# EAGLE schematic nerf_ammo_counter (EAGLE 9.3.0)
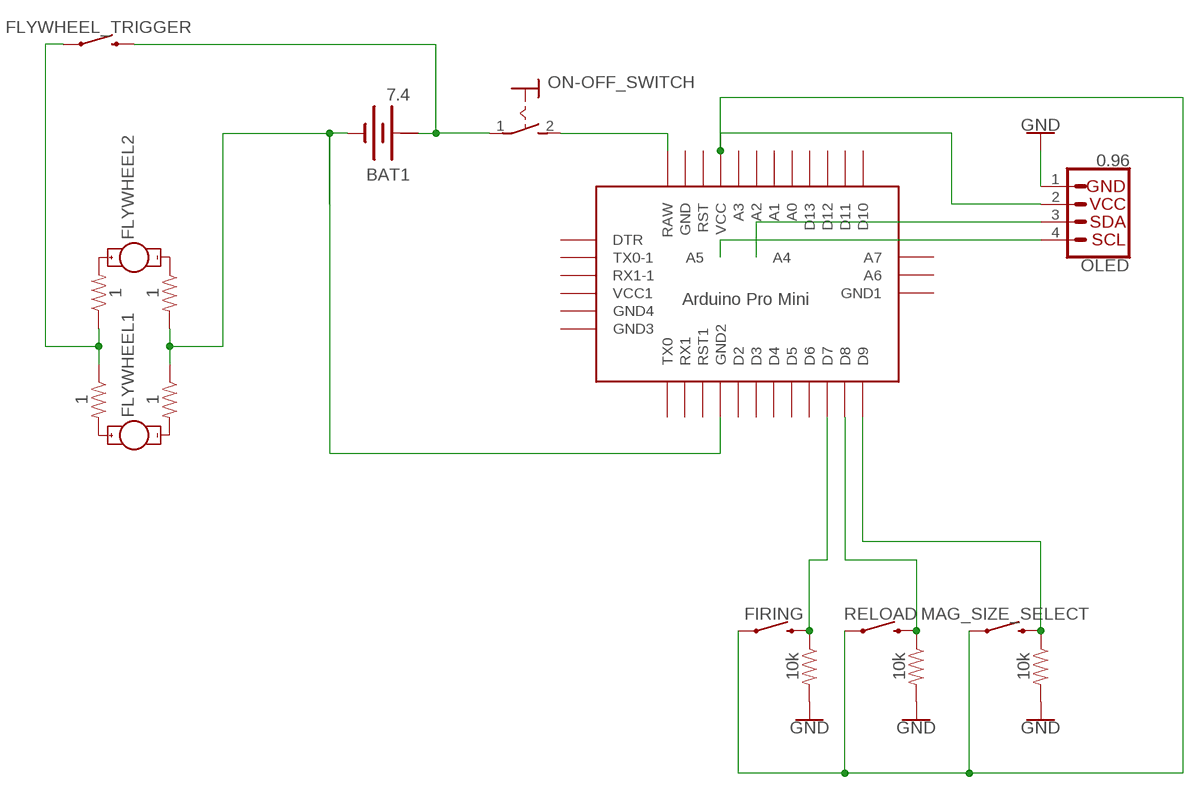
[diagram p0: schematic, sheet 1]

## Parts
BAT1  7.4  BATTERY  [BATTERY]
FIRING  MOMENTARY-SWITCH-SPST-PTH-6.0MM  [TACTILE_SWITCH_PTH_6.0MM]
FLYWHEEL1  MOTOR10MM  [VIBE-MOTOR-10MM]
FLYWHEEL2  MOTOR10MM  [VIBE-MOTOR-10MM]
FLYWHEEL_TRIGGER  MOMENTARY-SWITCH-SPST-PTH-6.0MM  [TACTILE_SWITCH_PTH_6.0MM]
MAG_SIZE_SELECT  MOMENTARY-SWITCH-SPST-PTH-6.0MM  [TACTILE_SWITCH_PTH_6.0MM]
OLED  0.96  I2C_STANDARD  [1X04]
ON-OFF_SWITCH  MS243  [MS243]
R1  10k  10KOHM-HORIZ-1/4W-1%  [AXIAL-0.3]
R2  10k  10KOHM-HORIZ-1/4W-1%  [AXIAL-0.3]
R3  10k  10KOHM-HORIZ-1/4W-1%  [AXIAL-0.3]
R4  1  1OHM-0603-1/10W-1%  [0603]
R5  1  1OHM-0603-1/10W-1%  [0603]
R6  1  1OHM-0603-1/10W-1%  [0603]
R7  1  1OHM-0603-1/10W-1%  [0603]
RELOAD  MOMENTARY-SWITCH-SPST-PTH-6.0MM  [TACTILE_SWITCH_PTH_6.0MM]
U$1  ABK-PRO-MINI  [ABK-PRO-MINI]

## Nets
GND: OLED.1 R1.P$2 R2.P$2 R3.P$2
N$1: OLED.4 U$1.A5
N$2: OLED.3 U$1.A4
N$3: FIRING.1 MAG_SIZE_SELECT.1 OLED.2 RELOAD.1 U$1.VCC
N$4: BAT1.- R6.2 R7.1 U$1.GND1(GND2)
N$5: ON-OFF_SWITCH.2(S) U$1.RAW
N$6: BAT1.+ FLYWHEEL_TRIGGER.3 ON-OFF_SWITCH.1(P)
N$7: MAG_SIZE_SELECT.3 R3.P$1 U$1.D9
N$9: R2.P$1 RELOAD.3 U$1.D8
N$10: FIRING.3 R1.P$1 U$1.D7
N$11: FLYWHEEL2.+ FLYWHEEL_TRIGGER.1 R4.1 R5.1 R5.2
N$12: FLYWHEEL2.- R6.1
N$13: FLYWHEEL1.- R7.2
N$14: FLYWHEEL1.+ R4.2
Unconnected: U$1.A0 U$1.A1 U$1.A2 U$1.A3 U$1.A6 U$1.A7 U$1.D2 U$1.D3 U$1.D4 U$1.D5 U$1.D6 U$1.D10 U$1.D11 U$1.D12 U$1.D13 U$1.DTR U$1.GND U$1.GND2(GND3) U$1.GND3(GND4) U$1.GND4(GND1) U$1.RST U$1.RST1 U$1.RX1 U$1.RX1-1 U$1.TX0 U$1.TX0-1 U$1.VCC1

## Power pins joined to a net without a drawn wire
+: BAT1.+@1(+)

## Library data of the parts
BAT1 = special:BATTERY: BATTERY
FIRING FLYWHEEL_TRIGGER MAG_SIZE_SELECT RELOAD = SparkFun-Switches:MOMENTARY-SWITCH-SPST: Momentary Switch (Pushbutton) - SPST Normally-open (NO) SPST momentary switches (buttons, pushbuttons). Variants PTH-12MM - 12mm square, through-hole Momentary Pushbutton Switch - 12mm Square <https://www.sparkfun.com/products/9190> (COM-09190) PTH-6.0MM, PTH-6.0MM-KIT - 6.0mm square, through-hole Mini Pushbutton Switch <https://www.sparkfun.com/products/97> (COM-00097) KIT package intended for soldering kit's - only one side of pads' copper is exposed. PTH-RIGHT-ANGLE-KIT - Right-angle, through-hole Right Angle Tactile Button <https://www.sparkfun.com/products/10791> - Used on SparkFun BigTime Watch Kit <https://www.sparkfun.com/products/11734> SMD-12MM - 12mm square, surface-mount Tactile Button - SMD (12mm) <https://www.sparkfun.com/products/12993> (COM-12993) Used on SparkFun PicoBoard <https://www.sparkfun.com/products/11888> SMD-4.5MM - 4.5mm Square Trackball Switch Used on SparkFun Blackberry Trackballer Breakout <https://www.sparkfun.com/products/13169> SMD-4.6MMX2.8MM - 4.60mm x 2.80mm, surface mount Used on SparkFun SAMD21 Mini Breakout <https://www.sparkfun.com/products/13664> SMD-5.2MM, SMD-5.2-REDUNDANT - 5.2mm square, surface-mount Mini Pushbutton Switch - SMD <https://www.sparkfun.com/products/8720> (COM-08720) Used on Arduino Pro Mini <https://www.sparkfun.com/products/11114> REDUNDANT package connects both switch circuits together SMD-6.0X3.5MM - 6.0 x 3.5mm, surface mount Momentary Reset Switch SMD <https://www.sparkfun.com/products/8229> (COM-08229) SMD-6.2MM-TALL - 6.2mm square, surface mount Tactile Button - SMD (6mm) <https://www.sparkfun.com/products/12992> Used on SparkFun Digital Sandbox <https://www.sparkfun.com/products/12651> SMD-RIGHT-ANGLE - Right-angle, surface mount Used on SparkFun Block for Intel® Edison - Arduino <https://www.sparkfun.com/products/13036>; PROD_ID: SWCH-08441; SF_SKU: COM-00097
FLYWHEEL1 FLYWHEEL2 = SparkFun-Electromechanical:MOTOR: Motor (Single-Phase) Two-terminal, single-phase motors. SparkFun Products Vibration Motor <https://www.sparkfun.com/products/8449> (ROB-08449) Physical dimension and wire connections for this powerful vibration motor. Motor has a self adhesive backing.; PROD_ID: COMP-08572; SF_SKU: ROB-08449
OLED = SparkFun-Connectors:I2C_STANDARD: SparkFun I2C Standard Pinout Header SparkFun has standardized on a pinout for all I2C based sensor breakouts. This pinout allows I2C boards to be plugged directly into the headers on Arduino Uno compatible boards, and to be daisy chained easily. Example SparkFun Products: SparkFun Atmospheric Sensor Breakout - BME280 <https://www.sparkfun.com/products/13676> SparkFun Altitude/Pressure Sensor Breakout - MPL3115A2 <https://www.sparkfun.com/products/11084> SparkFun TOF Range Finder Sensor - VL6180 <https://www.sparkfun.com/products/12785>
ON-OFF_SWITCH = switch:MS243: TOGGLE SWITCH
R1-R3 = SparkFun-Resistors:10KOHM: 10kΩ resistor A resistor is a passive two-terminal electrical component that implements electrical resistance as a circuit element. Resistors act to reduce current flow, and, at the same time, act to lower voltage levels within circuits. - Wikipedia; PROD_ID: RES-12183
R4-R7 = SparkFun-Resistors:1OHM: 1Ω resistor A resistor is a passive two-terminal electrical component that implements electrical resistance as a circuit element. Resistors act to reduce current flow, and, at the same time, act to lower voltage levels within circuits. - Wikipedia; PROD_ID: RES-08269
U$1 = Arduino-clone:ABK-PRO-MINI: ABK Pro-Mini Arduino Clone